# EasyEDA schematic Elaborato_2021-05-28.json

## Sheets
1 Differenziale_condizionamento: TITLE: Sheet_1; REV: 1.0; Date: 2021-04-03; Sheet: 1/1; Drawn By: Hi_world; Company: Your Company
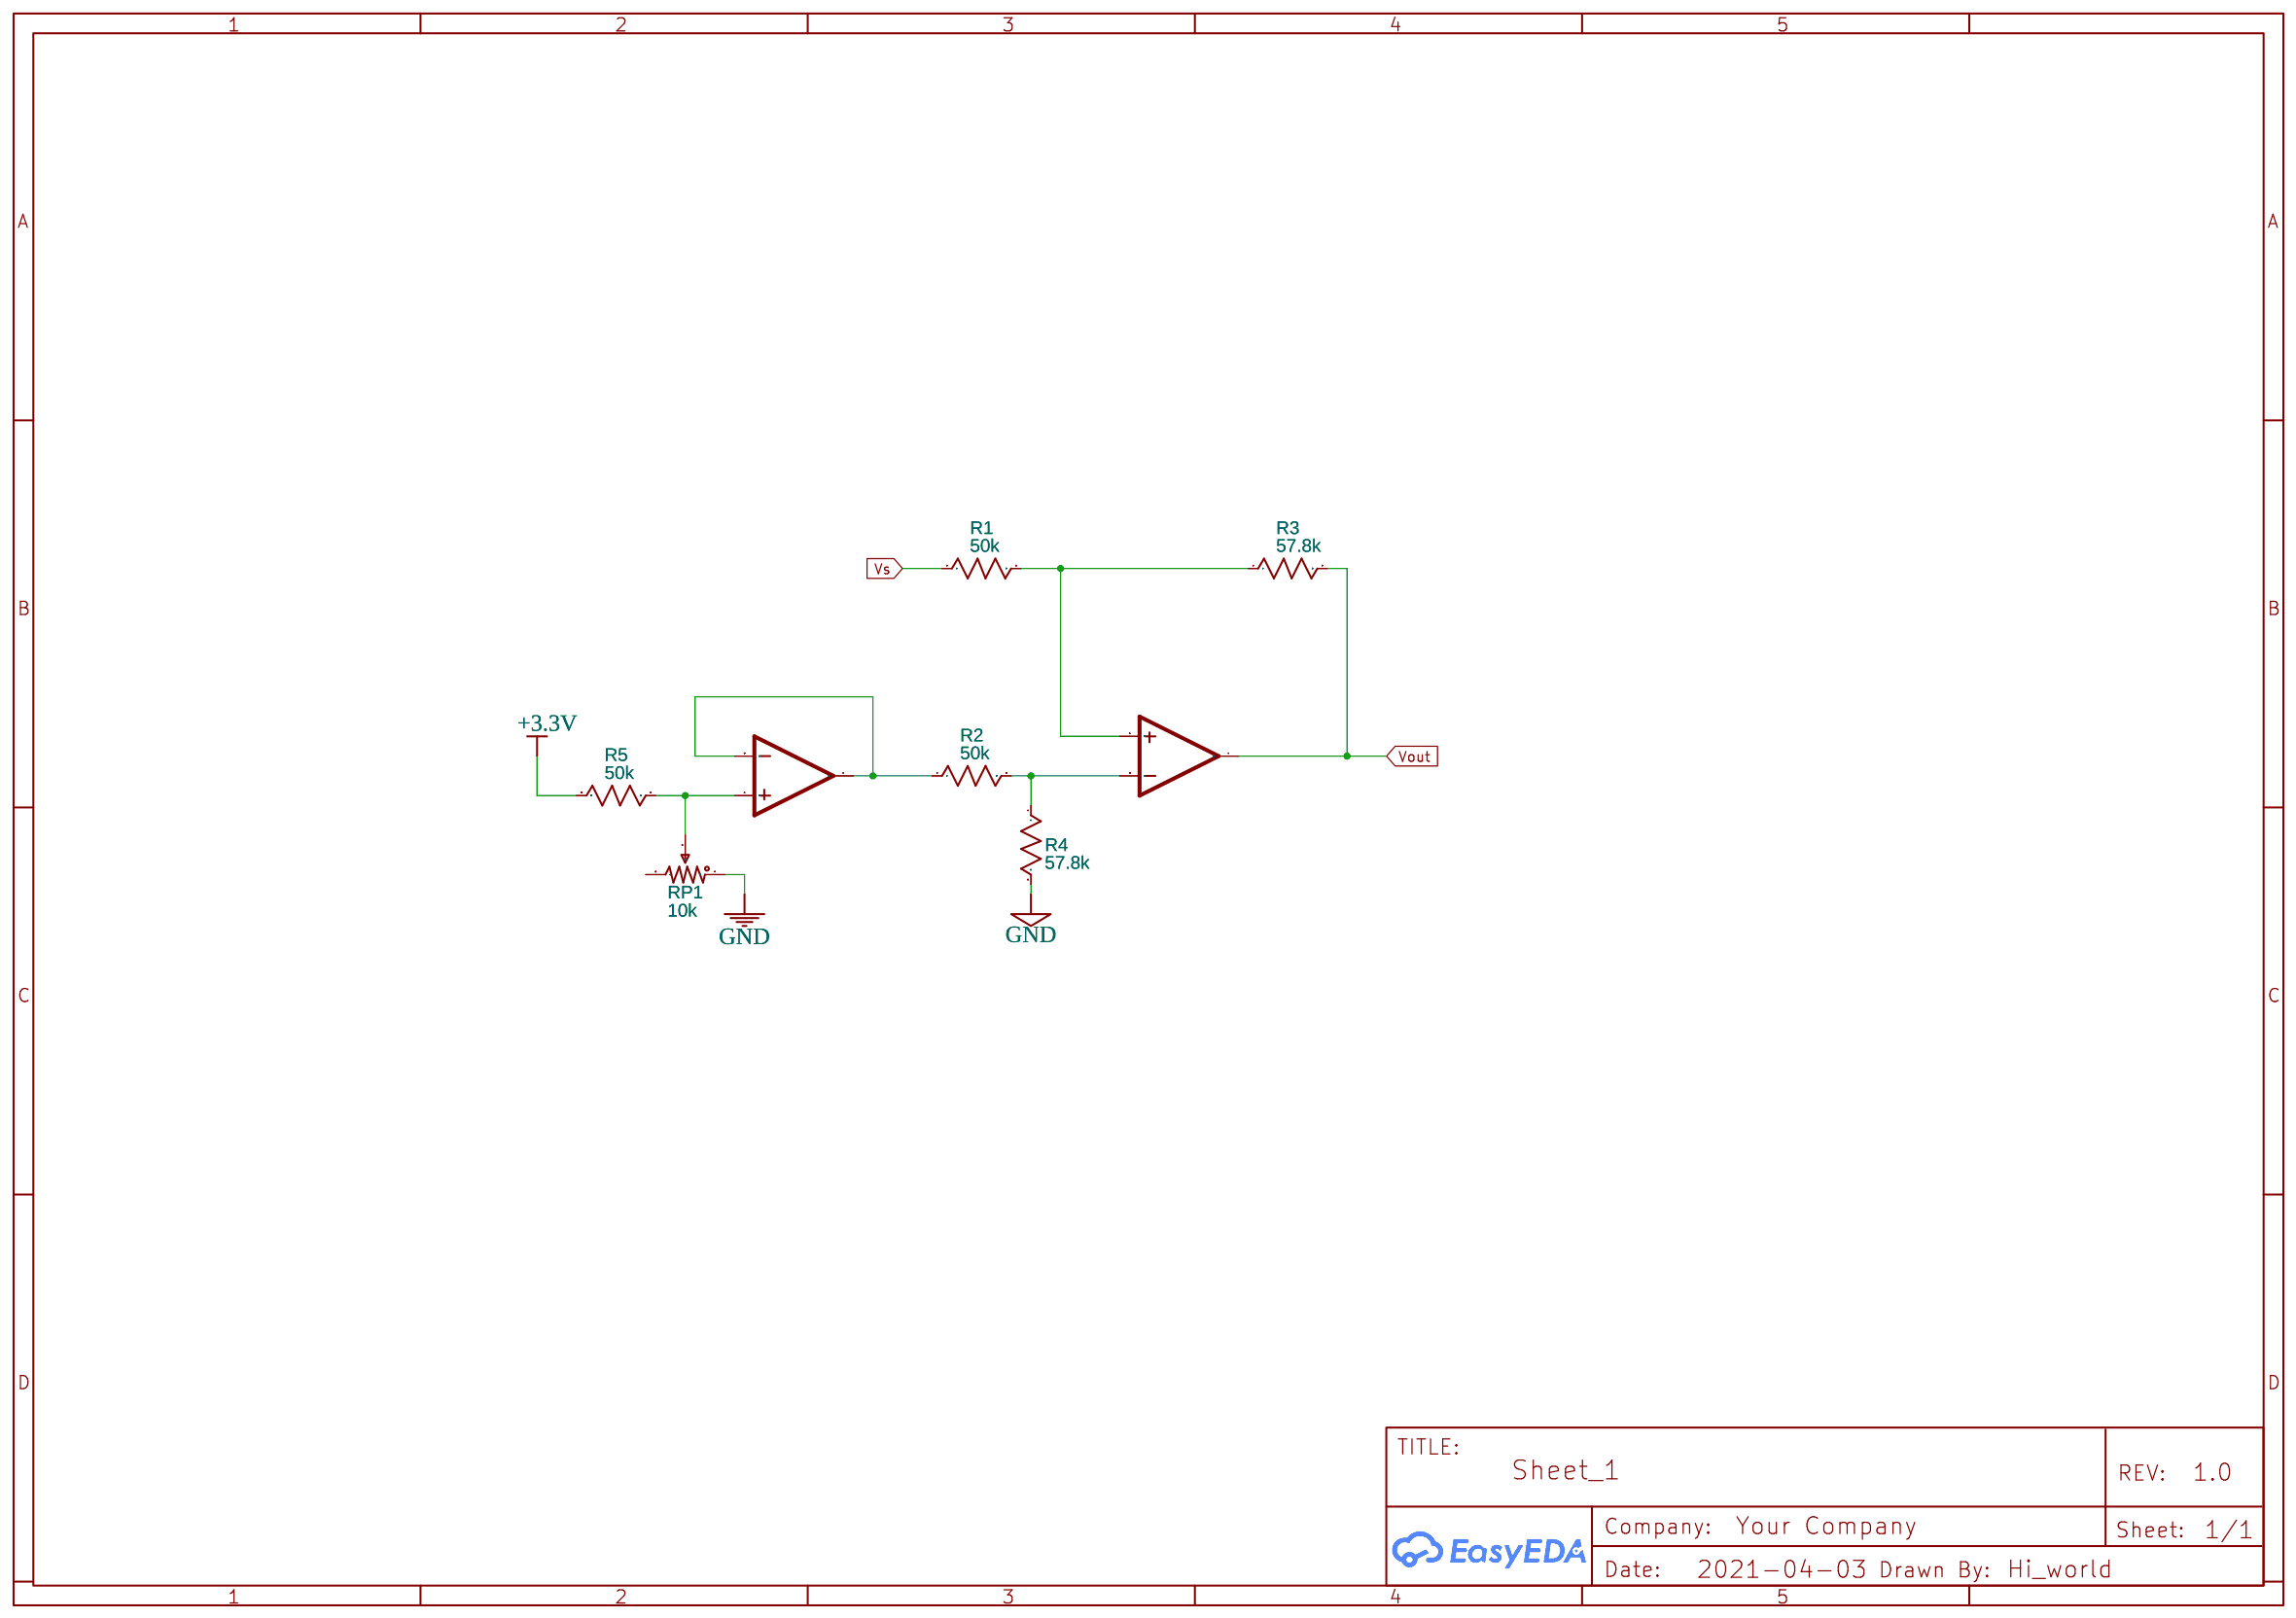
[diagram p0: Differenziale_condizionamento]
2 Pull_down: Date: 2021-05-26
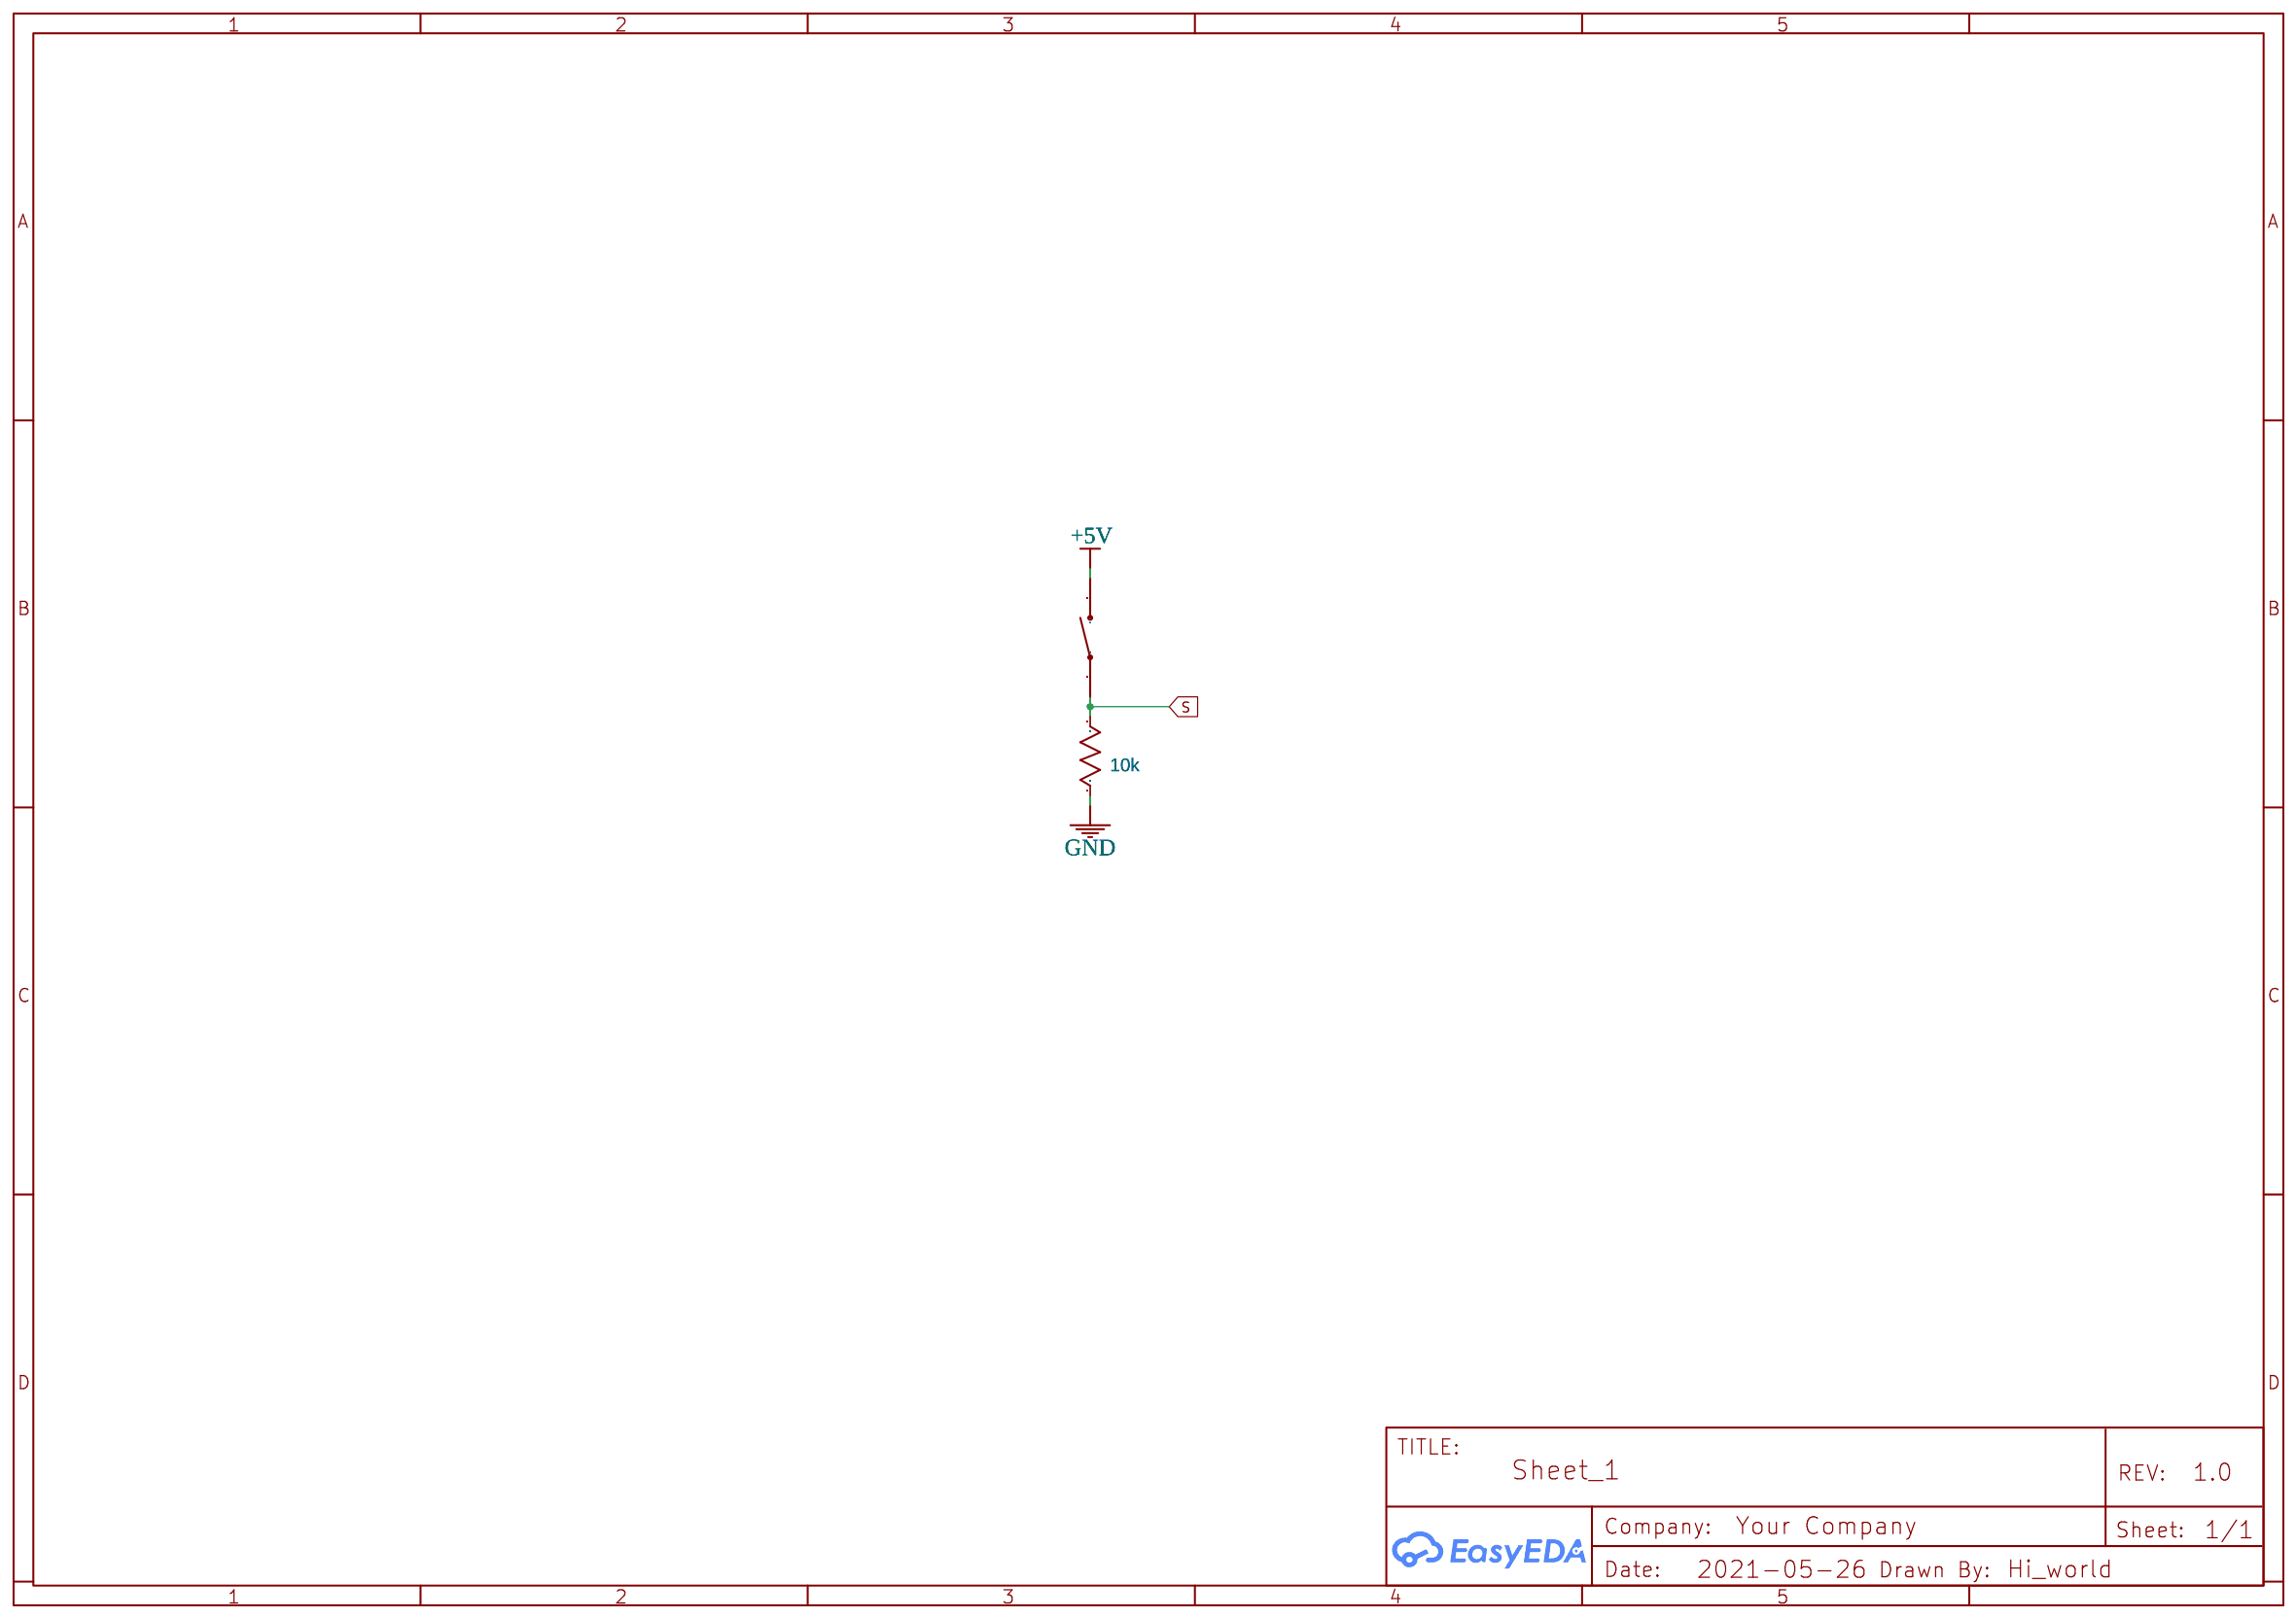
[diagram p1: Pull_down]
3 Complete_schematic: Date: 2021-05-27
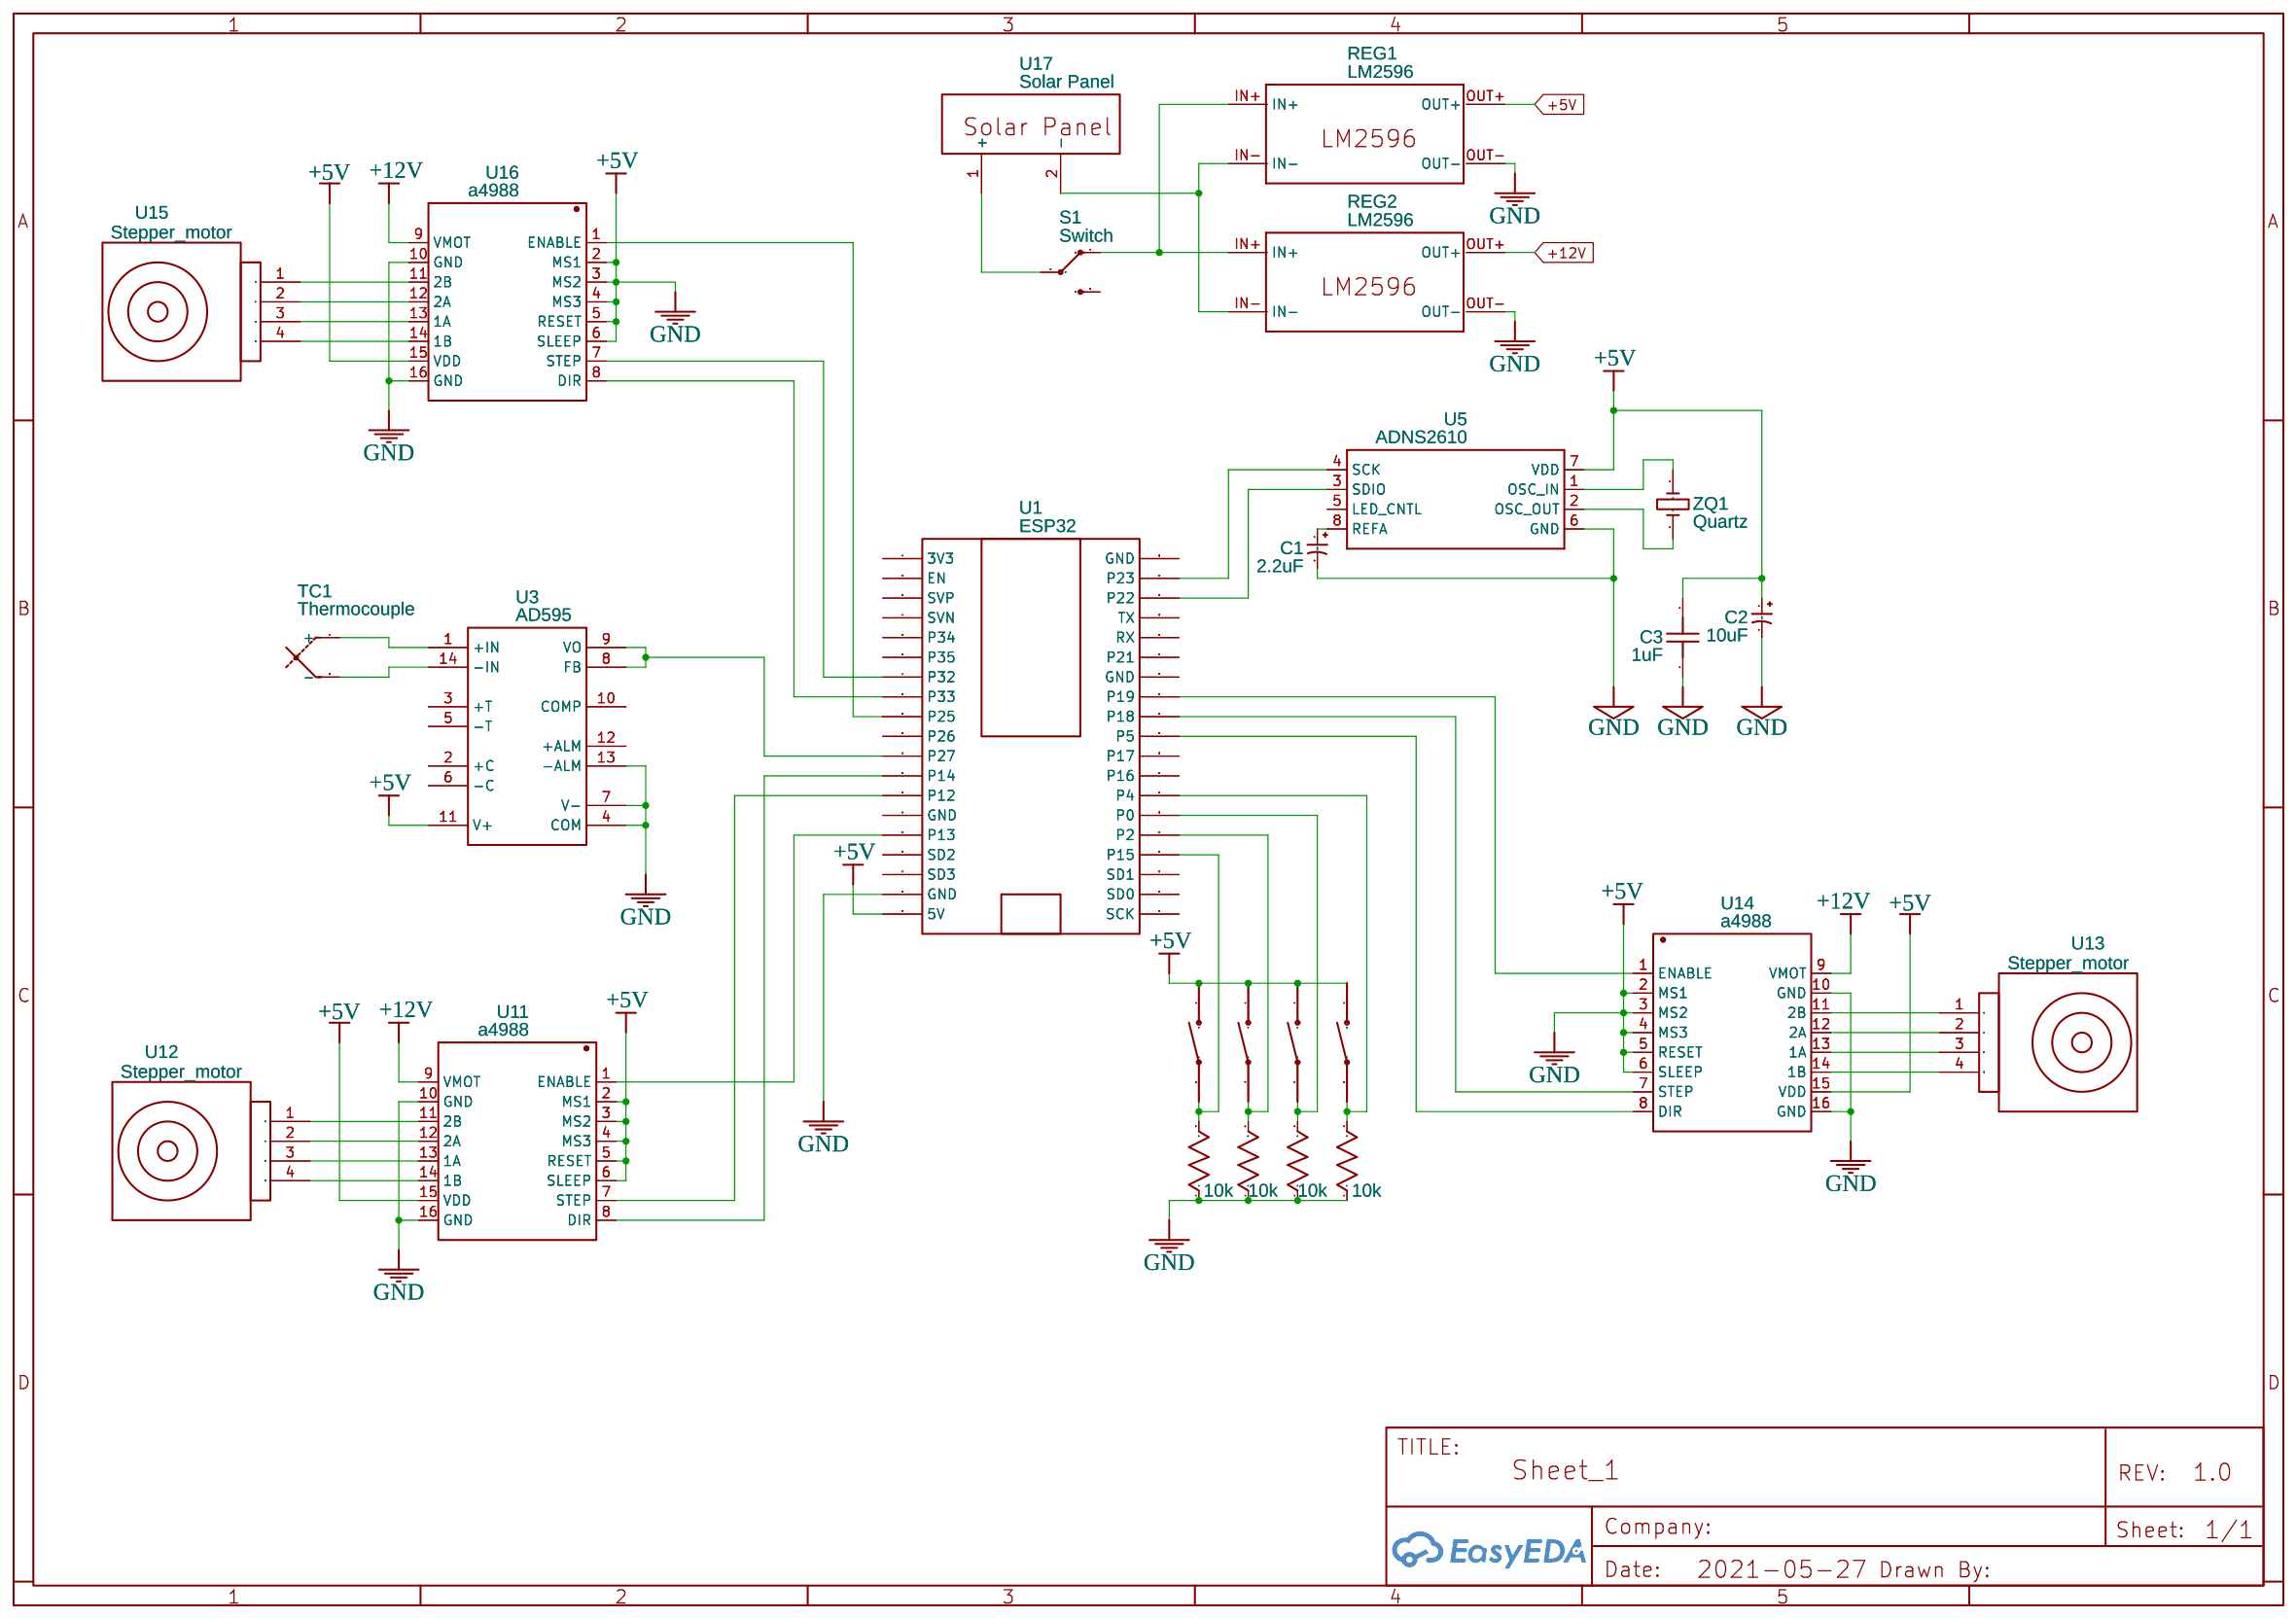
[diagram p2: Complete_schematic]

## Parts
sheet Complete_schematic
C1  2.2uF  [CAP_TH_5MM]
C2  10uF  [CAP_TH_5MM]
C3  1uF  [CAP_CERAMICO_PINES_A_5_MM]
R7  10k  [R0603]
R8  10k  [R0603]
R9  10k  [R0603]
R10  10k  [R0603]
REG1  LM2596  [LM2596]
REG2  LM2596  [LM2596]
S1  Switch  [SWITCH-SPDT]
TC1  Thermocouple
U1  ESP32  [ESP32]
U3  AD595  [DIP14]
U4  Switch basic
U5  ADNS2610  [ADNS2610]
U6  Switch basic
U7  Switch basic
U10  Switch basic
U11  a4988  [HTSSOP-28]
U12  Stepper_motor  [CONN-TH_4P_XHB-4A]
U13  Stepper_motor  [CONN-TH_4P_XHB-4A]
U14  a4988  [HTSSOP-28]
U15  Stepper_motor  [CONN-TH_4P_XHB-4A]
U16  a4988  [HTSSOP-28]
U17  Solar Panel  [SOLAR_PANEL]
ZQ1  Quartz  [QUARTZ]
sheet Differenziale_condizionamento
R1  50k  [R0603]
R2  50k  [R0603]
R3  57.8k  [R0603]
R4  57.8k  [R0603]
R5  50k  [R0603]
RP1  10k  [RES-ADJ-TH_3386P]
U8  Op amp  [SEEED-SC-70-5]
U9  Op amp  [SEEED-SC-70-5]
sheet Pull_down
R6  10k  [R0603]
U2  Switch basic

## Library data of the parts
C1 C2 = Capacitor electrolitico 5mm: Contributor: otanezlor
C3 = Capacitor ceramico 5mm.PEQUEÑO: Contributor: amocachi
R1-R10 = R_0603_US: Contributor: LCEDA_Lib
REG1 REG2 = LM2596: Contributor: Kevin Kwok
S1 = Switch: sourceId: ceKgMGAuL
TC1 = Thermocouple: Contributor: KiCAD; license: https://www.gnu.org/licenses/lgpl-2.1.html
U1 = ESP32: Manufacturer: HiLetgo; Manufacturer Part: ESP-32S; Supplier Part: ESP-32S; link: https://github.com/espressif/arduino-esp32; Contributor: sandvikcity
U3 = AD595ADZ: K-Type Thermocouple Amplifier with Cold Junction Compensation, 5 to +-15 V Supply, Industrial, 14-pin DIP (D-14), Tube
U2 U4 U6 U7 U10 = Switch basic: Manufacturer Part: Switch; Contributor: Hi_world
U5 = ADNS2610: Contributor: Hi_world
U11 U14 U16 = a4988: Supplier Part: C81582; Supplier: LCSC; Manufacturer: TI; Manufacturer Part: DRV8825PWPR; Contributor: jgiral95
U12 U13 U15 = Stepper_motor: Manufacturer Part: NEMA 23 Stepper Motor; Contributor: Hi_world
U17 = Solar Panel: Contributor: meier.romeo
ZQ1 = Quartz: Manufacturer Part: New SchematicLib; Contributor: kivanychev
RP1 = R_3386P_US: Supplier: LCSC; Contributor: LCEDA_Lib; value(Ω): 10K
U8 U9 = Op amp: SMD IC Amplifier;; sourceId: bl9lUSs2C; Supplier Part: 310020013; Supplier: SeeedStudio; Manufacturer Part: LMV321IDCKR

## Nets
+3.3V: R5.2
+5V: C1.2 C2.1 C2.2 C3.1 C3.2 R4.2 R6.1 R7.1 R8.1 R9.1 R10.1 REG1.OUT+ REG1.OUT- REG2.OUT- RP1.1 U1.18(GND) U1.19(5V) U2.1 U3.4(COM) U3.7(V-) U3.11(V+) U3.13(-ALM) U4.1 U5.6(GND) U5.7(VDD) U6.1 U7.1 U10.1 U11.2(MS1) U11.3(MS2) U11.4(MS3) U11.5(RESET) U11.6(SLEEP) U11.10(GND) U11.15(VDD) U11.16(GND) U14.2(MS1) U14.3(MS2) U14.4(MS3) U14.5(RESET) U14.6(SLEEP) U14.10(GND) U14.15(VDD) U14.16(GND) U16.2(MS1) U16.3(MS2) U16.4(MS3) U16.5(RESET) U16.6(SLEEP) U16.10(GND) U16.15(VDD) U16.16(GND)
+12V: REG2.OUT+ U11.9(VMOT) U14.9(VMOT) U16.9(VMOT)
S: R6.2 U2.2
Vout: R3.2 U9.4(OUT)
Vs: R1.1
Net-(C1-1): C1.1 U5.8(REFA)
Net-(R1-2): R1.2 R3.1 U9.1(IN+)
Net-(R2-1): R2.1 U8.3(IN-) U8.4(OUT)
Net-(R2-2): R2.2 R4.1 U9.3(IN-)
Net-(R5-1): R5.1 RP1.2 U8.1(IN+)
Net-(R7-2): R7.2 U1.23(P15) U4.2
Net-(R8-2): R8.2 U1.24(P2) U6.2
Net-(R9-2): R9.2 U1.25(P0) U7.2
Net-(R10-2): R10.2 U1.26(P4) U10.2
Net-(REG1-IN+): REG1.IN+ REG2.IN+ S1.1(O)
Net-(REG1-IN-): REG1.IN- REG2.IN- U17.2(-)
Net-(S1-2): S1.2(P) U17.1(+)
Net-(TC1-1): TC1.1(+) U3.1(+IN)
Net-(TC1-2): TC1.2(-) U3.14(-IN)
Net-(U1-7): U1.7(P32) U16.7(STEP)
Net-(U1-8): U1.8(P33) U16.8(DIR)
Net-(U1-9): U1.9(P25) U16.1(ENABLE)
Net-(U1-11): U1.11(P27) U3.8(FB) U3.9(VO)
Net-(U1-12): U1.12(P14) U11.8(DIR)
Net-(U1-13): U1.13(P12) U11.7(STEP)
Net-(U1-15): U1.15(P13) U11.1(ENABLE)
Net-(U1-29): U1.29(P5) U14.8(DIR)
Net-(U1-30): U1.30(P18) U14.7(STEP)
Net-(U1-31): U1.31(P19) U14.1(ENABLE)
Net-(U1-36): U1.36(P22) U5.3(SDIO)
Net-(U1-37): U1.37(P23) U5.4(SCK)
Net-(U5-1): U5.1(OSC_IN) ZQ1.2
Net-(U5-2): U5.2(OSC_OUT) ZQ1.1
Net-(U11-11): U11.11(2B) U12.1(A+)
Net-(U11-12): U11.12(2A) U12.2(A-)
Net-(U11-13): U11.13(1A) U12.3(B+)
Net-(U11-14): U11.14(1B) U12.4(B-)
Net-(U13-1): U13.1(A+) U14.11(2B)
Net-(U13-2): U13.2(A-) U14.12(2A)
Net-(U13-3): U13.3(B+) U14.13(1A)
Net-(U13-4): U13.4(B-) U14.14(1B)
Net-(U15-1): U15.1(A+) U16.11(2B)
Net-(U15-2): U15.2(A-) U16.12(2A)
Net-(U15-3): U15.3(B+) U16.13(1A)
Net-(U15-4): U15.4(B-) U16.14(1B)

Not connected (* = marked no-connect by the designer): RP1 3; S1 3(S); U1 1(3V3) 2(EN) 3(SVP) 4(SVN) 5(P34) 6(P35) 10(P26) 14(GND) 16(SD2) 17(SD3) 20(SCK) 21(SD0) 22(SD1) 27(P16) 28(P17) 32(GND) 33(P21) 34(RX) 35(TX) 38(GND); U3 2(+C) 3(+T) 5(-T) 6(-C) 10(COMP) 12(+ALM); U5 5(LED_CNTL)
